# Altium schematic sheet AUDIO_CODEC_CS4270.SchDoc: Audio CODEC
size A4; Revision: .01; SheetNumber: 9; SheetTotal: 12; Organization: Altium Limited.; Address1: Level 3, 12a Rodborough Rd; Address2: Frenchs Forest 2086; Address3: NSW; Address4: AUSTRALIA
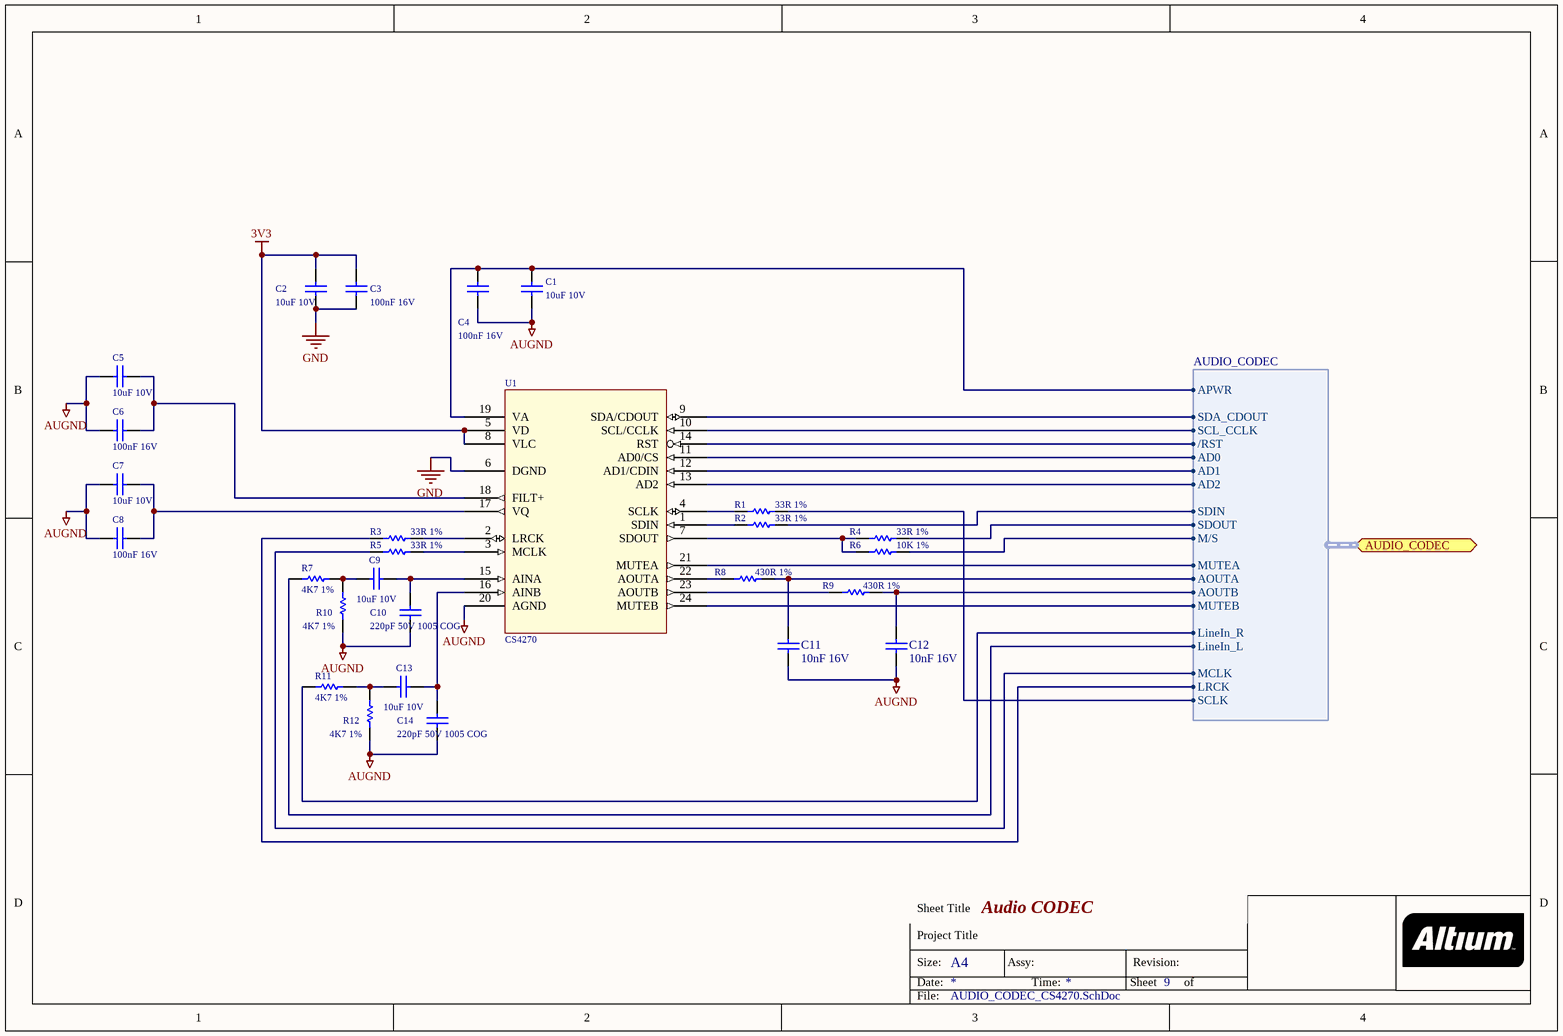
[diagram p0: AUDIO_CODEC_CS4270.SchDoc]

## Parts
C1  10uF 10V  [CAPC2012-STAR]
C2  10uF 10V  [CAPC2012-STAR]
C3  100nF 16V  [CAPC1005-STAR]
C4  100nF 16V  [CAPC1005-STAR]
C5  10uF 10V  [CAPC2012-STAR]
C6  100nF 16V  [CAPC1005-STAR]
C7  10uF 10V  [CAPC2012-STAR]
C8  100nF 16V  [CAPC1005-STAR]
C9  10uF 10V  [CAPC2012-STAR]
C10  220pF 50V 1005 COG  [CAPC1005-STAR]
C11  10nF 16V  [CAPC1005-STAR]
C12  10nF 16V  [CAPC1005-STAR]
C13  10uF 10V  [CAPC2012-STAR]
C14  220pF 50V 1005 COG  [CAPC1005-STAR]
R1  33R 1%  [RESC1005-STAR]
R2  33R 1%  [RESC1005-STAR]
R3  33R 1%  [RESC1005-STAR]
R4  33R 1%  [RESC1005-STAR]
R5  33R 1%  [RESC1005-STAR]
R6  10K 1%  [RESC1005-STAR]
R7  4K7 1%  [RESC1005-STAR]
R8  430R 1%  [RESC1005-STAR]
R9  430R 1%  [RESC1005-STAR]
R10  4K7 1%  [RESC1005-STAR]
R11  4K7 1%  [RESC1005-STAR]
R12  4K7 1%  [RESC1005-STAR]
U1  CS4270  [TSSOP-24]

## Ports
AUDIO_CODEC (harness AUDIO_CODEC)

## Harnesses
AUDIO_CODEC: SDOUT, SDIN, SCLK, LRCK, MCLK, M/S, LineIn_L, LineIn_R, AOUTA, AOUTB, APWR, SCL_CCLK, AD1, SDA_CDOUT, AD0, AD2, /RST, MUTEA, MUTEB

## Nets
3V3: C2.1 C3.1 U1.5(VD) U1.8(VLC)
AUGND: C1.2 C4.2 C5.2 C6.1 C7.2 C8.2 C10.2 C11.2 C12.2 C14.2 R10.1 R12.1 U1.20(AGND)
GND: C2.2 C3.2 U1.6(DGND)
NetC1_1: C1.1 C4.1 U1.19(VA) ; port AUDIO_CODEC.APWR
NetC5_1: C5.1 C6.2 U1.18(FILT+)
NetC7_1: C7.1 C8.1 U1.17(VQ)
NetC9_1: C9.1 C10.1 U1.15(AINA)
NetC9_2: C9.2 R7.2 R10.2
NetC11_1: C11.1 R8.1 ; port AUDIO_CODEC.AOUTA
NetC12_1: C12.1 R9.1 ; port AUDIO_CODEC.AOUTB
NetC13_1: C13.1 C14.1 U1.16(AINB)
NetC13_2: C13.2 R11.2 R12.2
NetR1_1: R1.1 U1.4(SCLK)
NetR1_2: R1.2 ; port AUDIO_CODEC.SCLK
NetR2_1: R2.1 U1.1(SDIN)
NetR2_2: R2.2 ; port AUDIO_CODEC.SDIN
NetR3_1: R3.1 ; port AUDIO_CODEC.LRCK
NetR3_2: R3.2 U1.2(LRCK)
NetR4_1: R4.1 R6.2 U1.7(SDOUT)
NetR4_2: R4.2 ; port AUDIO_CODEC.SDOUT
NetR5_1: R5.1 ; port AUDIO_CODEC.MCLK
NetR5_2: R5.2 U1.3(MCLK)
NetR6_1: R6.1 ; port AUDIO_CODEC.M/S
NetR7_1: R7.1 ; port AUDIO_CODEC.LineIn_L
NetR8_2: R8.2 U1.22(AOUTA)
NetR9_2: R9.2 U1.23(AOUTB)
NetR11_1: R11.1 ; port AUDIO_CODEC.LineIn_R
NetU1_9: U1.9(SDA/CDOUT) ; port AUDIO_CODEC.SDA_CDOUT
NetU1_10: U1.10(SCL/CCLK) ; port AUDIO_CODEC.SCL_CCLK
NetU1_11: U1.11(AD0/CS) ; port AUDIO_CODEC.AD0
NetU1_12: U1.12(AD1/CDIN) ; port AUDIO_CODEC.AD1
NetU1_13: U1.13(AD2) ; port AUDIO_CODEC.AD2
NetU1_14: U1.14(RST) ; port AUDIO_CODEC./RST
NetU1_21: U1.21(MUTEA) ; port AUDIO_CODEC.MUTEA
NetU1_24: U1.24(MUTEB) ; port AUDIO_CODEC.MUTEB

## Notes on the sheet
- Sheet Title
- Project Title
- Size:
- Date:
- A4
- Assy:
- Time:
- Sheet
- Revision:
- of
- File:

## Library data of the parts
C1 C2 C5 C7 C9 C13 = D-101-0087: Capacitor, Ceramic, 10uF 10% 10V 0805 (2012) X5R; Polarity: Non-Polarized; Capacitance: 10 uF; Dielectric: X5R; Mounting Technology: Surface Mount; Rated Voltage: 10 V; Status: Unreleased; Technology: None; Tolerance: 10 %; Category: Capacitor
C3 C4 C6 C8 = D-101-0062: Capacitor, Ceramic, 100nF 10% 16V 0402 (1005) X7R; Polarity: Non-Polarized; Capacitance: 100 nF; Dielectric: X7R; Mounting Technology: Surface Mount; Rated Voltage: 16 V; Status: Unreleased; Technology: Ceramic; Tolerance: 10 %; Category: Capacitor
C10 C14 = D-101-0064: Capacitor, Ceramic, 220pF 5% 50V 0402 (1005) COG; Polarity: Non-Polarized; Capacitance: 220 pF; Dielectric: COG; Mounting Technology: Surface Mount; Rated Voltage: 50 V; Status: Unreleased; Technology: Ceramic; Tolerance: 5 %; Category: Capacitor
C11 C12 = D-101-0077: Capacitor, Ceramic, 10nF 10% 16V 0402 (1005) X7R; Polarity: Non-Polarized; Capacitance: 10 nF; Category: Capacitor; Dielectric: X7R; Mounting Technology: Surface Mount; Rated Voltage: 16 V; Status: Production; Technology: Ceramic; Tolerance: 10 %
R1-R5 = D-100-0102: Resistor, 33R 1% 0402 (1005); Power Rating: 63 mW; Mounting Technology: Surface Mount; Resistance: 33 R; Status: Production; Tolerance: 1 %; Category: Resistor
R6 = D-100-0130: Resistor, 10K 1% 0402 (1005); Power Rating: 63 mW; Mounting Technology: Surface Mount; Resistance: 10 K; Status: Production; Tolerance: 1 %; Category: Resistor
R7 R10-R12 = D-100-0088: Resistor, 4K7 1% 0402 (1005); Power Rating: 63 mW; Resistance: 4.7 K; Mounting Technology: Surface Mount; Status: Production; Tolerance: 1 %; Category: Resistor
R8 R9 = D-100-0096: Resistor, 430R 1% 0402 (1005); Power Rating: 63 mW; Category: Resistor; Mounting Technology: Surface Mount; Resistance: 430 R; Status: Production; Tolerance: 1 %
U1 = D-201-0003: CS4270; 24-Bit, 192 kHz Stereo Audio CODEC; AudioICTypes: Amplifier; Supply Voltage: mV; Mounting Technology: Surface Mount; Status: Unreleased; Category: IC-Audio